# Altium schematic sheet [02] - BLOCK DIAGRAM.SchDoc
size Letter; CheckedBy: Pablo M.; DocumentNumber: 2; Revision: v1; SheetNumber: 2; SheetTotal: 5
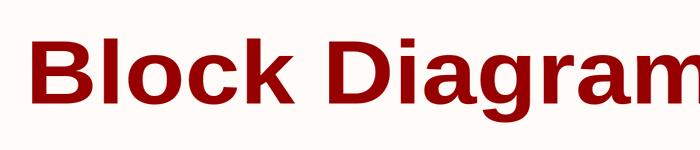
[diagram p0: [02] - BLOCK DIAGRAM.SchDoc]

## Notes on the sheet
- Block Diagram
- Project Name:
- Page Contents:
- Size:
- Revision:
- Letter
- Design:
- Document Number:
- Date:
- Sheet:
- of